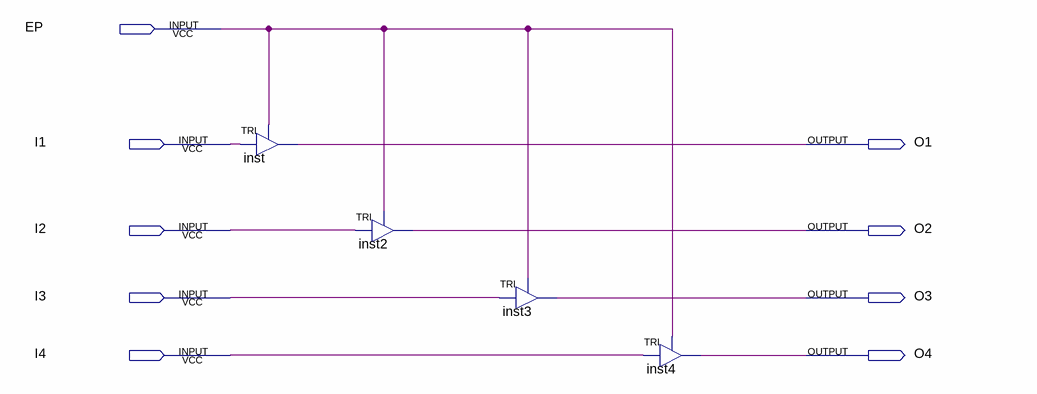
[diagram p0: schematic sheet]
// Quartus schematic ALP74LS126.bdf as structural Verilog: 4 symbols, 9 pins
module ALP74LS126 (
  input  EP,
  input  I1,
  input  I2,
  input  I3,
  input  I4,
  output O1,
  output O2,
  output O3,
  output O4
);

  TRI inst (.IN(I1), .OE(EP), .OUT(O1));
  TRI inst2 (.IN(I2), .OE(EP), .OUT(O2));
  TRI inst3 (.IN(I3), .OE(EP), .OUT(O3));
  TRI inst4 (.IN(I4), .OE(EP), .OUT(O4));
endmodule
